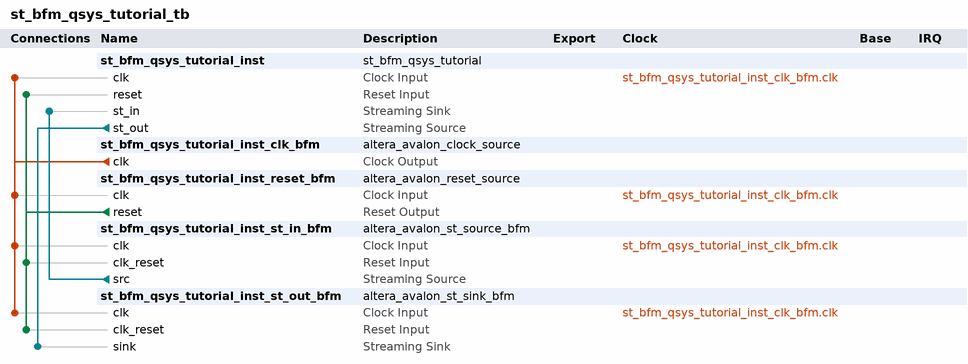
[diagram p0: system contents]
# Platform Designer (Qsys) system st_bfm_qsys_tutorial_tb, Cyclone V Unknown
# Parameters at their usual value, and those the tool derives, are not listed.
package require -exact qsys 13.1
create_system st_bfm_qsys_tutorial_tb
set_project_property DEVICE_FAMILY {Cyclone V}
set_project_property DEVICE Unknown

add_instance st_bfm_qsys_tutorial_inst st_bfm_qsys_tutorial 1.0

add_instance st_bfm_qsys_tutorial_inst_clk_bfm altera_avalon_clock_source 13.1

add_instance st_bfm_qsys_tutorial_inst_reset_bfm altera_avalon_reset_source 13.1
set_instance_parameter_value st_bfm_qsys_tutorial_inst_reset_bfm ASSERT_HIGH_RESET 1
set_instance_parameter_value st_bfm_qsys_tutorial_inst_reset_bfm INITIAL_RESET_CYCLES 50

add_instance st_bfm_qsys_tutorial_inst_st_in_bfm altera_avalon_st_source_bfm 13.1
set_instance_parameter_value st_bfm_qsys_tutorial_inst_st_in_bfm USE_PACKET 1
set_instance_parameter_value st_bfm_qsys_tutorial_inst_st_in_bfm USE_CHANNEL 1
set_instance_parameter_value st_bfm_qsys_tutorial_inst_st_in_bfm USE_ERROR 1
set_instance_parameter_value st_bfm_qsys_tutorial_inst_st_in_bfm USE_READY 1
set_instance_parameter_value st_bfm_qsys_tutorial_inst_st_in_bfm USE_VALID 1
set_instance_parameter_value st_bfm_qsys_tutorial_inst_st_in_bfm USE_EMPTY 1
set_instance_parameter_value st_bfm_qsys_tutorial_inst_st_in_bfm ST_SYMBOL_W 8
set_instance_parameter_value st_bfm_qsys_tutorial_inst_st_in_bfm ST_NUMSYMBOLS 4
set_instance_parameter_value st_bfm_qsys_tutorial_inst_st_in_bfm ST_CHANNEL_W 3
set_instance_parameter_value st_bfm_qsys_tutorial_inst_st_in_bfm ST_ERROR_W 3
set_instance_parameter_value st_bfm_qsys_tutorial_inst_st_in_bfm ST_MAX_CHANNELS 7

add_instance st_bfm_qsys_tutorial_inst_st_out_bfm altera_avalon_st_sink_bfm 13.1
set_instance_parameter_value st_bfm_qsys_tutorial_inst_st_out_bfm USE_PACKET 1
set_instance_parameter_value st_bfm_qsys_tutorial_inst_st_out_bfm USE_CHANNEL 1
set_instance_parameter_value st_bfm_qsys_tutorial_inst_st_out_bfm USE_ERROR 1
set_instance_parameter_value st_bfm_qsys_tutorial_inst_st_out_bfm USE_READY 1
set_instance_parameter_value st_bfm_qsys_tutorial_inst_st_out_bfm USE_VALID 1
set_instance_parameter_value st_bfm_qsys_tutorial_inst_st_out_bfm USE_EMPTY 1
set_instance_parameter_value st_bfm_qsys_tutorial_inst_st_out_bfm ST_SYMBOL_W 8
set_instance_parameter_value st_bfm_qsys_tutorial_inst_st_out_bfm ST_NUMSYMBOLS 4
set_instance_parameter_value st_bfm_qsys_tutorial_inst_st_out_bfm ST_CHANNEL_W 3
set_instance_parameter_value st_bfm_qsys_tutorial_inst_st_out_bfm ST_ERROR_W 3
set_instance_parameter_value st_bfm_qsys_tutorial_inst_st_out_bfm ST_READY_LATENCY 0
set_instance_parameter_value st_bfm_qsys_tutorial_inst_st_out_bfm ST_MAX_CHANNELS 7
set_instance_parameter_value st_bfm_qsys_tutorial_inst_st_out_bfm VHDL_ID 0

# connections
add_connection st_bfm_qsys_tutorial_inst_clk_bfm.clk st_bfm_qsys_tutorial_inst.clk clock
add_connection st_bfm_qsys_tutorial_inst_clk_bfm.clk st_bfm_qsys_tutorial_inst_reset_bfm.clk clock
add_connection st_bfm_qsys_tutorial_inst_clk_bfm.clk st_bfm_qsys_tutorial_inst_st_in_bfm.clk clock
add_connection st_bfm_qsys_tutorial_inst_clk_bfm.clk st_bfm_qsys_tutorial_inst_st_out_bfm.clk clock
add_connection st_bfm_qsys_tutorial_inst_reset_bfm.reset st_bfm_qsys_tutorial_inst.reset reset
add_connection st_bfm_qsys_tutorial_inst_reset_bfm.reset st_bfm_qsys_tutorial_inst_st_in_bfm.clk_reset reset
add_connection st_bfm_qsys_tutorial_inst_reset_bfm.reset st_bfm_qsys_tutorial_inst_st_out_bfm.clk_reset reset
add_connection st_bfm_qsys_tutorial_inst.st_out st_bfm_qsys_tutorial_inst_st_out_bfm.sink avalon_streaming
add_connection st_bfm_qsys_tutorial_inst_st_in_bfm.src st_bfm_qsys_tutorial_inst.st_in avalon_streaming

set_interconnect_requirement {$system} qsys_mm.clockCrossingAdapter HANDSHAKE
set_interconnect_requirement {$system} qsys_mm.maxAdditionalLatency 1
set_interconnect_requirement {$system} qsys_mm.insertDefaultSlave false

save_system st_bfm_qsys_tutorial_tb.qsys
